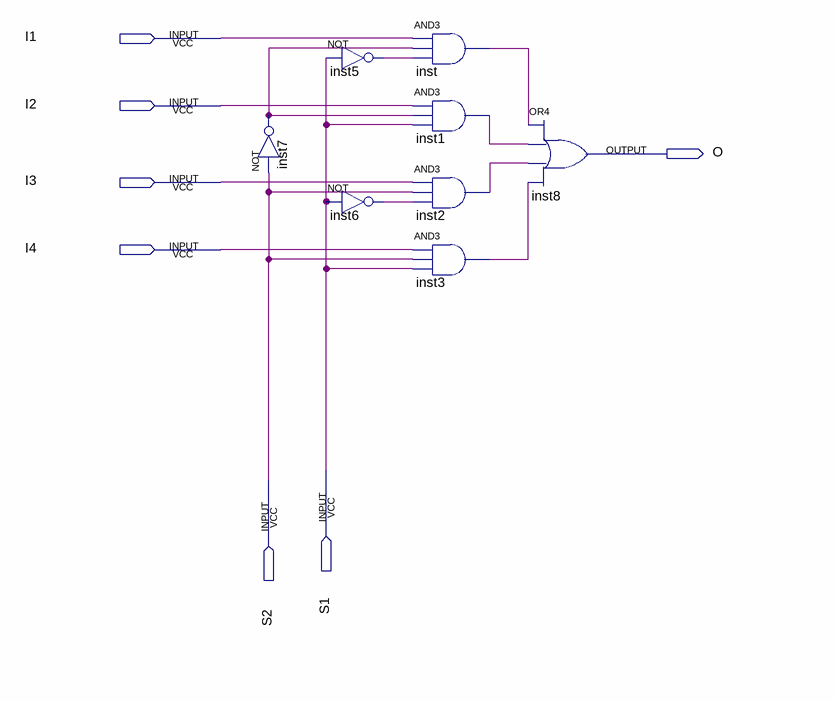
[diagram p0: schematic sheet]
// Quartus schematic mux_4x1.bdf as structural Verilog: 8 symbols, 7 pins
module mux_4x1 (
  input  I1,
  input  I2,
  input  I3,
  input  I4,
  input  S1,
  input  S2,
  output O
);

  wire inst1_out, inst2_out, inst3_out, inst5_out, inst6_out, inst7_out, inst_out;

  not inst7 (inst7_out, S2);
  not inst5 (inst5_out, S1);
  not inst6 (inst6_out, S1);
  and inst (inst_out, I1, inst7_out, inst5_out);
  and inst1 (inst1_out, I2, inst7_out, S1);
  and inst2 (inst2_out, I3, S2, inst6_out);
  and inst3 (inst3_out, I4, S2, S1);
  or inst8 (O, inst_out, inst1_out, inst2_out, inst3_out);
endmodule
